# EAGLE design X13_Power_Distribution_C (EAGLE 9.6.2)
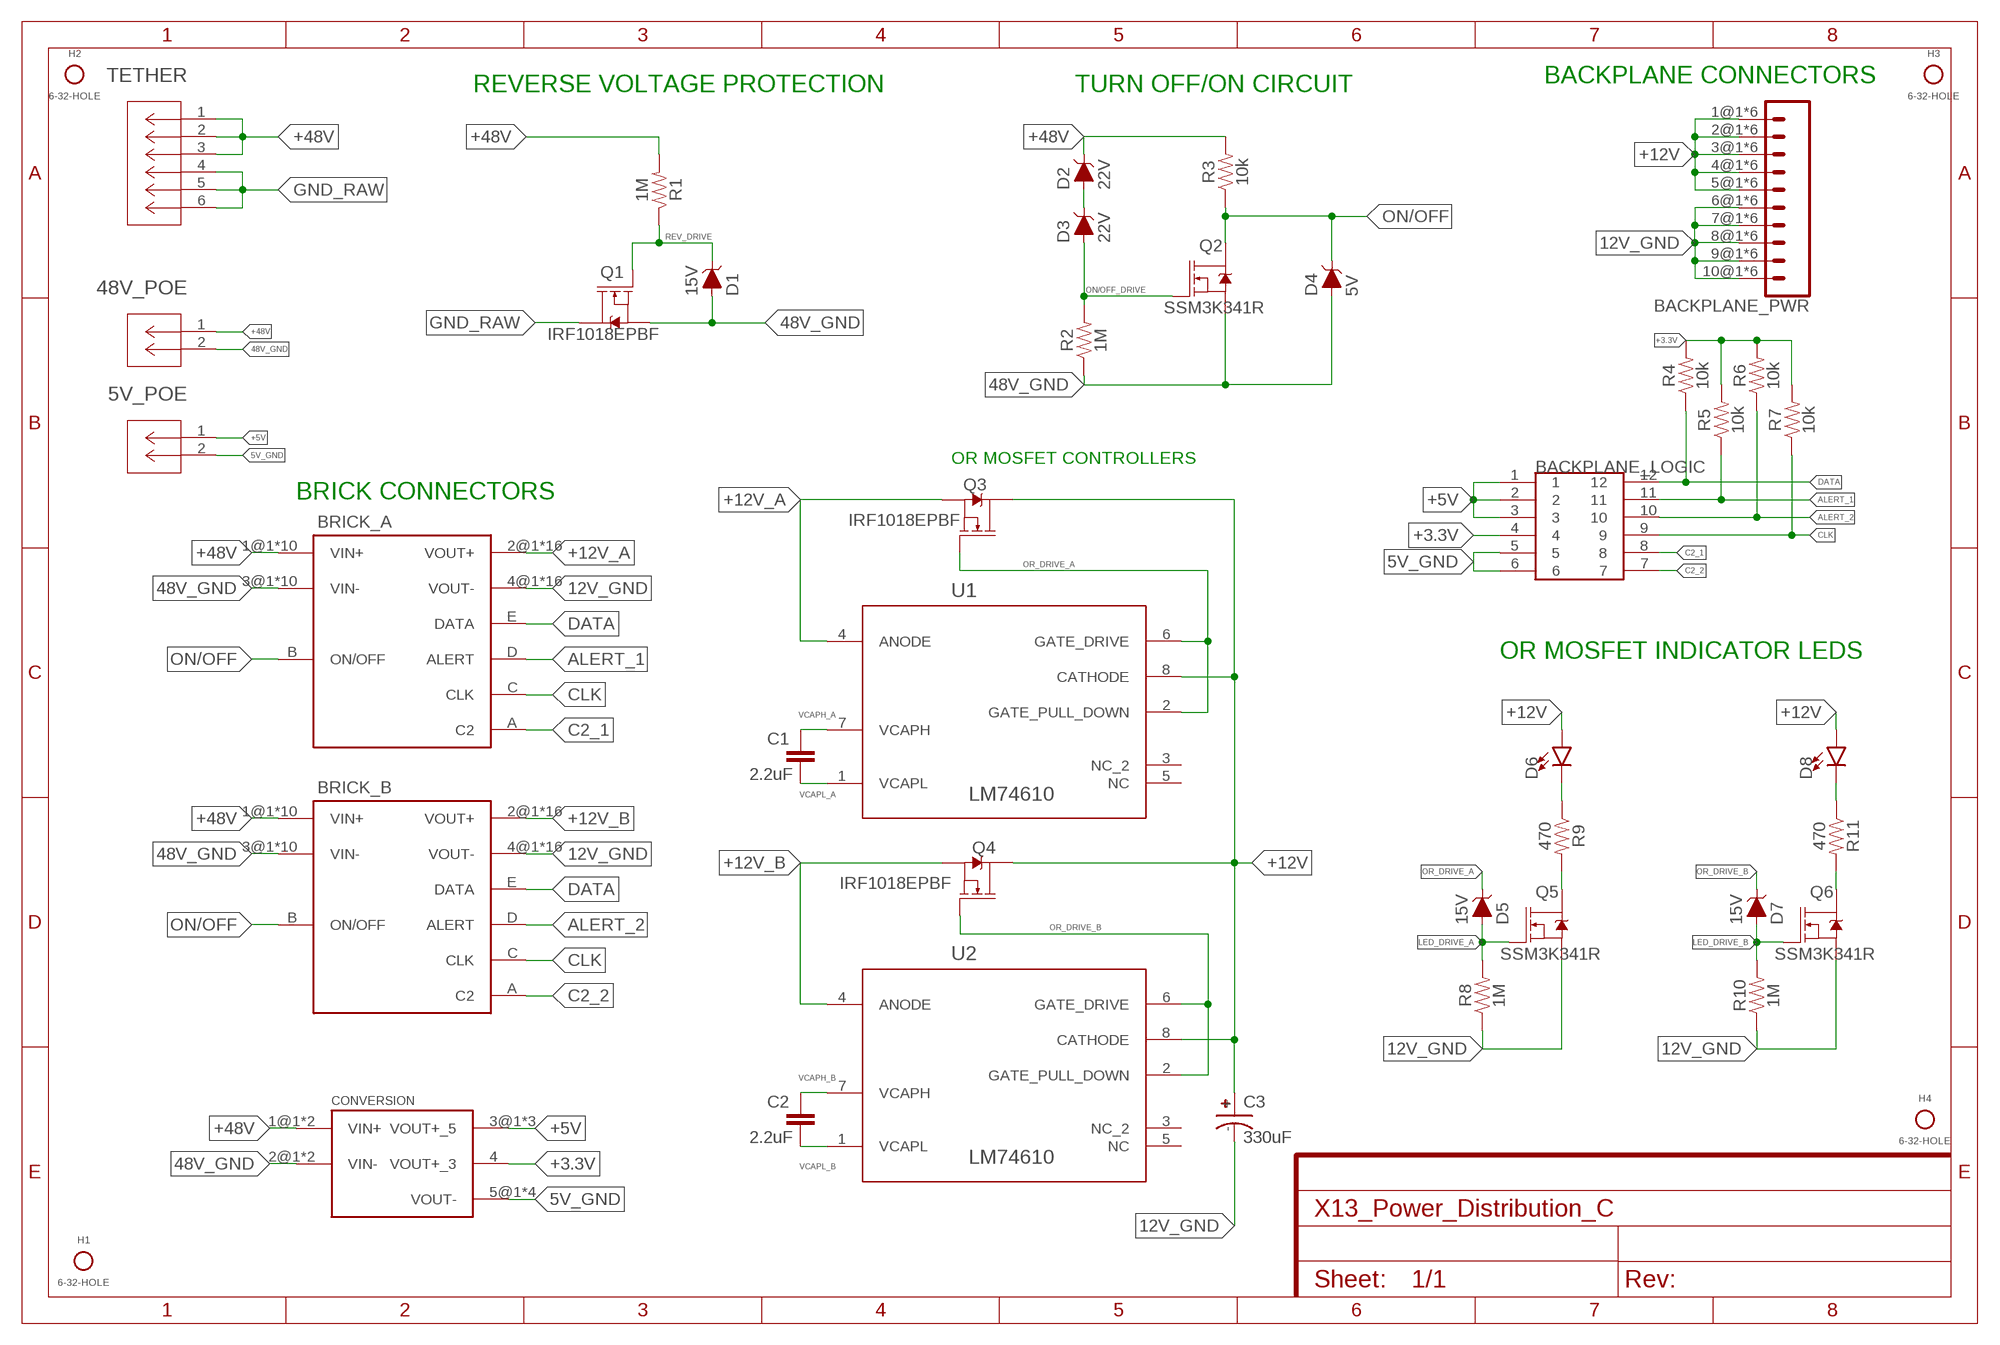
[diagram p0: schematic, sheet 1, part 1 of 2]
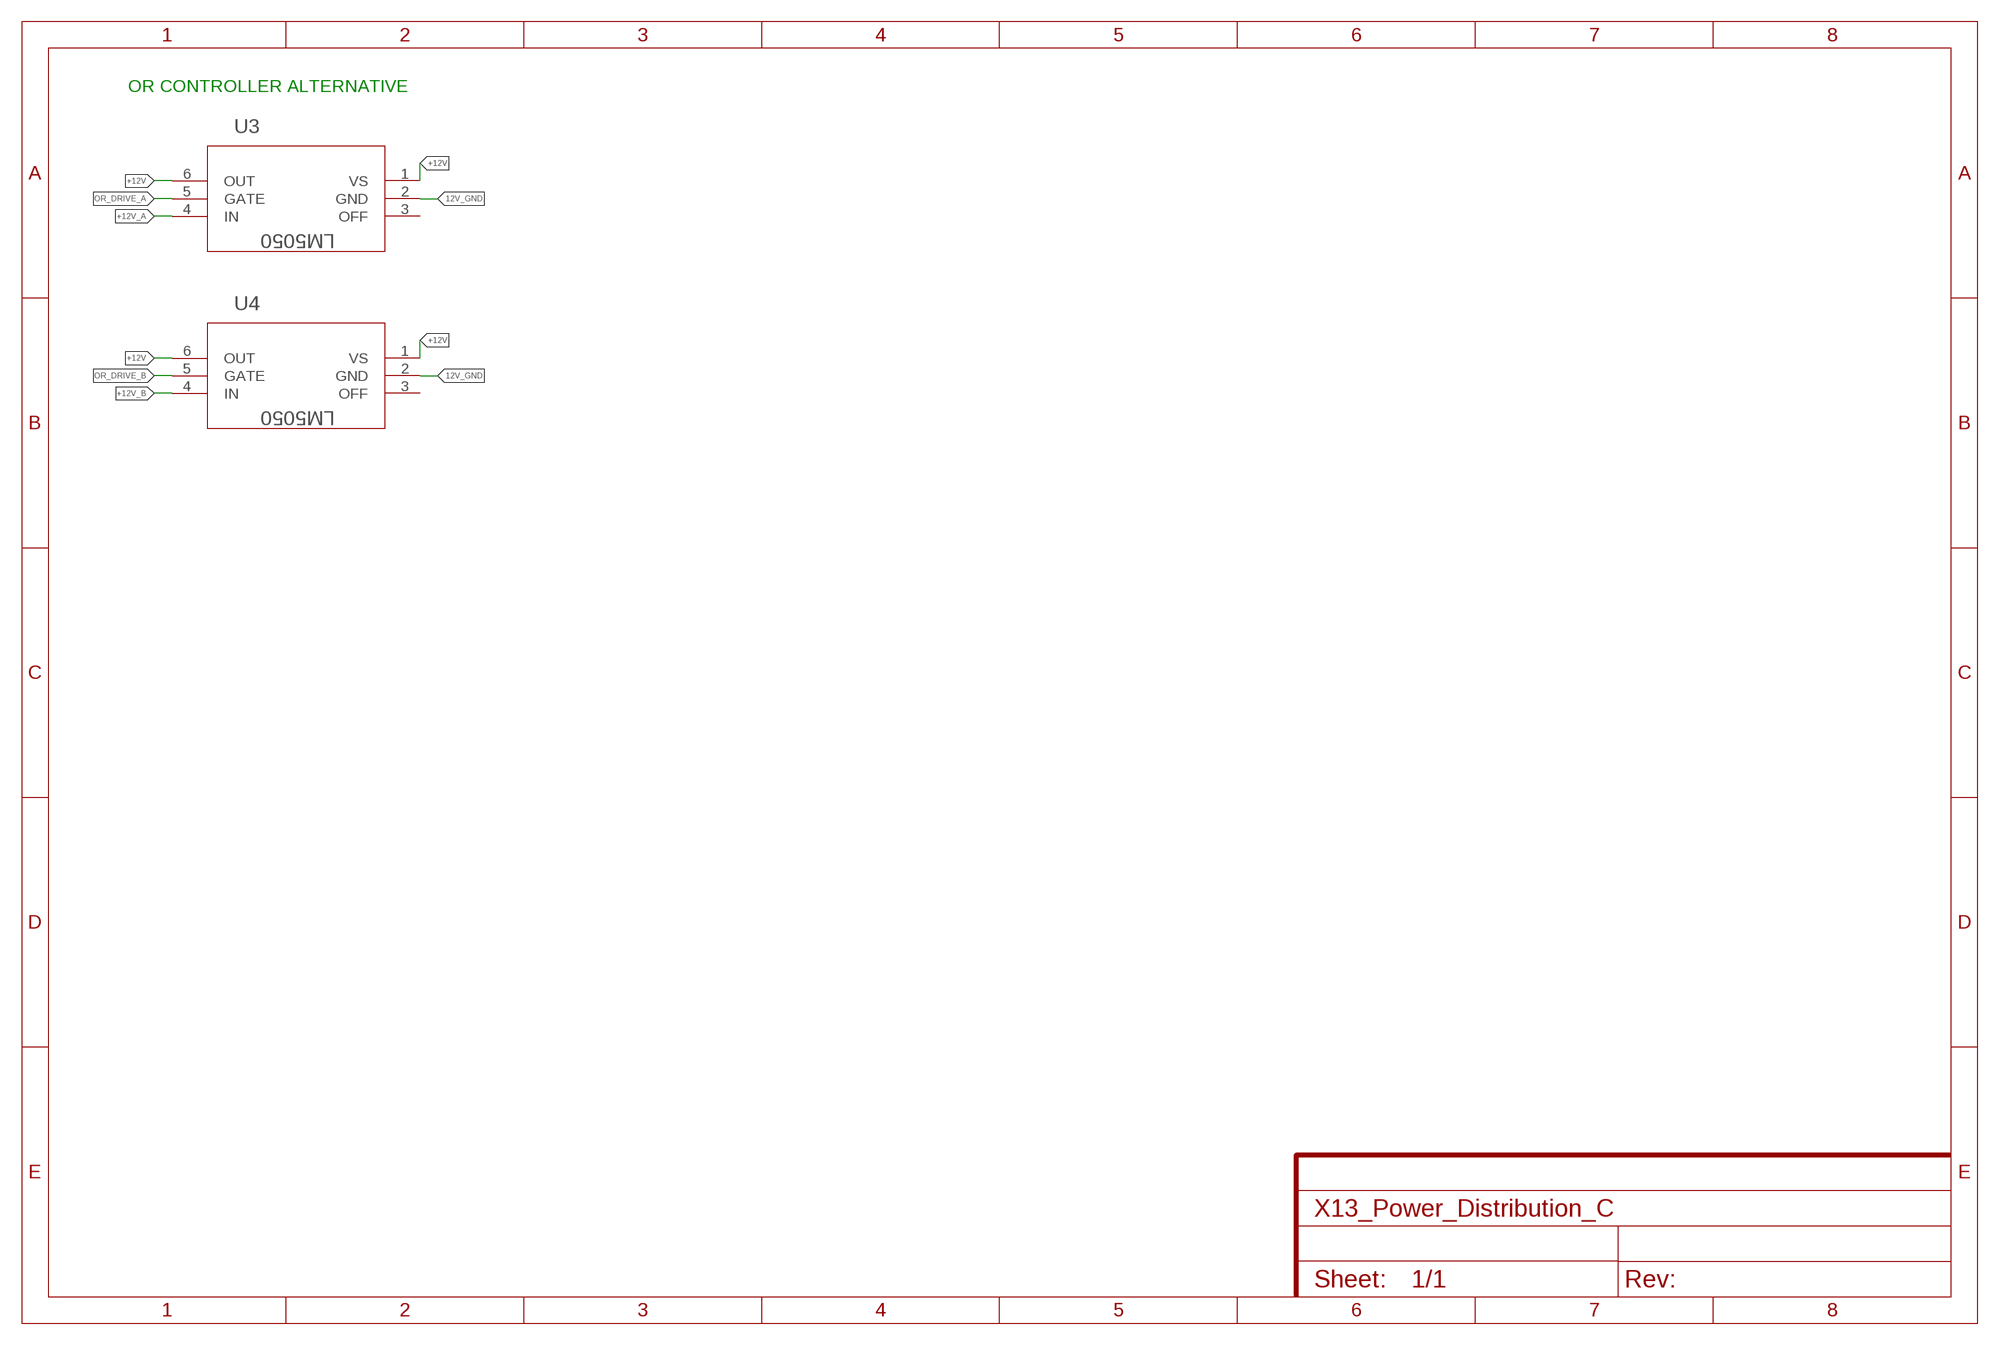
[diagram p1: schematic, sheet 1, part 2 of 2]

## Parts
5V_POE  POE_TERMINAL  [CONN2_282834-2_TEC]
48V_POE  POE_TERMINAL  [CONN2_282834-2_TEC]
BACKPLANE_LOGIC  IPL1-106-01-L-D-RE1-K  [IPL1-106-01-L-D-RE1-K]
BACKPLANE_PWR  MPPT-10-01-01-L-RA-SD  [MPPT-10-01-01-L-RA-SD]
BRICK_A  DIST2BRICK_C  [DIST2BRICK_C]
BRICK_B  DIST2BRICK_C  [DIST2BRICK_C]
C1  2.2uF  0.1UF-0603-100V-10%  [0603]
C2  2.2uF  0.1UF-0603-100V-10%  [0603]
C3  330uF  UCM1H331MNL1GS  [CAPAE1030X1050N]
CONVERSION  DIST2CON  [DIST2CON]
D1  15V  DIODE-ZENER-BZT52C3V6S  [SOD-323]
D2  22V  DIODE-ZENER-BZT52C3V6S  [SOD-323]
D3  22V  DIODE-ZENER-BZT52C3V6S  [SOD-323]
D4  5V  DIODE-ZENER-BZT52C3V6S  [SOD-323]
D5  15V  DIODE-ZENER-BZT52C3V6S  [SOD-323]
D6  LED0603  [LED-0603]
D7  15V  DIODE-ZENER-BZT52C3V6S  [SOD-323]
D8  LED0603  [LED-0603]
H1  6-32-HOLE  [6-32-HOLE]
H2  6-32-HOLE  [6-32-HOLE]
H3  6-32-HOLE  [6-32-HOLE]
H4  6-32-HOLE  [6-32-HOLE]
Q1  IRF1018EPBF  [TO263]
Q2  SSM3K341R  MOSFET-NCH-2N7002PW  [SOT323]
Q3  IRF1018EPBF  [TO263]
Q4  IRF1018EPBF  [TO263]
Q5  SSM3K341R  MOSFET-NCH-2N7002PW  [SOT323]
Q6  SSM3K341R  MOSFET-NCH-2N7002PW  [SOT323]
R1  1M  RESISTOR0603  [0603]
R2  1M  RESISTOR0603  [0603]
R3  10k  RESISTOR0603  [0603]
R4  10k  RESISTOR0603  [0603]
R5  10k  RESISTOR0603  [0603]
R6  10k  RESISTOR0603  [0603]
R7  10k  RESISTOR0603  [0603]
R8  1M  RESISTOR0603  [0603]
R9  470  RESISTOR0603  [0603]
R10  1M  RESISTOR0603  [0603]
R11  470  RESISTOR0603  [0603]
TETHER  48V  DIST_TO_TETHER  [CON6_P5MM_VER_TERM-BLK_TYC]
U1  LM74610  DIST_OR_DIODEDGK0008A_M  [DGK0008A_M]
U2  LM74610  DIST_OR_DIODEDGK0008A_M  [DGK0008A_M]
U3  LM5050  DIST_OR_CONTROL_ALTMK06A-M  [MK06A-M]
U4  LM5050  DIST_OR_CONTROL_ALTMK06A-M  [MK06A-M]

## Nets
5V_GND: 5V_POE.2 BACKPLANE_LOGIC.5 BACKPLANE_LOGIC.6 CONVERSION.5@1(VOUT-) CONVERSION.5@2(VOUT-) CONVERSION.5@3(VOUT-) CONVERSION.5@4(VOUT-)
12V_GND: BACKPLANE_PWR.6@1 BACKPLANE_PWR.6@2 BACKPLANE_PWR.6@3 BACKPLANE_PWR.6@4 BACKPLANE_PWR.6@5 BACKPLANE_PWR.6@6 BACKPLANE_PWR.7@1 BACKPLANE_PWR.7@2 BACKPLANE_PWR.7@3 BACKPLANE_PWR.7@4 BACKPLANE_PWR.7@5 BACKPLANE_PWR.7@6 BACKPLANE_PWR.8@1 BACKPLANE_PWR.8@2 BACKPLANE_PWR.8@3 BACKPLANE_PWR.8@4 BACKPLANE_PWR.8@5 BACKPLANE_PWR.8@6 BACKPLANE_PWR.9@1 BACKPLANE_PWR.9@2 BACKPLANE_PWR.9@3 BACKPLANE_PWR.9@4 BACKPLANE_PWR.9@5 BACKPLANE_PWR.9@6 BACKPLANE_PWR.10@1 BACKPLANE_PWR.10@2 BACKPLANE_PWR.10@3 BACKPLANE_PWR.10@4 BACKPLANE_PWR.10@5 BACKPLANE_PWR.10@6 BRICK_A.4@1(VOUT-) BRICK_A.4@2(VOUT-) BRICK_A.4@3(VOUT-) BRICK_A.4@4(VOUT-) BRICK_A.4@5(VOUT-) BRICK_A.4@6(VOUT-) BRICK_A.4@7(VOUT-) BRICK_A.4@8(VOUT-) BRICK_A.4@9(VOUT-) BRICK_A.4@10(VOUT-) BRICK_A.4@11(VOUT-) BRICK_A.4@12(VOUT-) BRICK_A.4@13(VOUT-) BRICK_A.4@14(VOUT-) BRICK_A.4@15(VOUT-) BRICK_A.4@16(VOUT-) BRICK_B.4@1(VOUT-) BRICK_B.4@2(VOUT-) BRICK_B.4@3(VOUT-) BRICK_B.4@4(VOUT-) BRICK_B.4@5(VOUT-) BRICK_B.4@6(VOUT-) BRICK_B.4@7(VOUT-) BRICK_B.4@8(VOUT-) BRICK_B.4@9(VOUT-) BRICK_B.4@10(VOUT-) BRICK_B.4@11(VOUT-) BRICK_B.4@12(VOUT-) BRICK_B.4@13(VOUT-) BRICK_B.4@14(VOUT-) BRICK_B.4@15(VOUT-) BRICK_B.4@16(VOUT-) C3.- Q5.2(S) Q6.2(S) R8.1 R10.1 U3.2(GND) U4.2(GND)
48V_GND: 48V_POE.2 BRICK_A.3@1(VIN-) BRICK_A.3@2(VIN-) BRICK_A.3@3(VIN-) BRICK_A.3@4(VIN-) BRICK_A.3@5(VIN-) BRICK_A.3@6(VIN-) BRICK_A.3@7(VIN-) BRICK_A.3@8(VIN-) BRICK_A.3@9(VIN-) BRICK_A.3@10(VIN-) BRICK_B.3@1(VIN-) BRICK_B.3@2(VIN-) BRICK_B.3@3(VIN-) BRICK_B.3@4(VIN-) BRICK_B.3@5(VIN-) BRICK_B.3@6(VIN-) BRICK_B.3@7(VIN-) BRICK_B.3@8(VIN-) BRICK_B.3@9(VIN-) BRICK_B.3@10(VIN-) CONVERSION.2@1(VIN-) CONVERSION.2@2(VIN-) D1.A D4.A Q1.2(S) Q2.2(S) R2.1
+3.3V: BACKPLANE_LOGIC.4 CONVERSION.4(VOUT+_3) R4.2 R5.2 R6.2 R7.2
+5V: 5V_POE.1 BACKPLANE_LOGIC.1 BACKPLANE_LOGIC.2 BACKPLANE_LOGIC.3 CONVERSION.3@1(VOUT+_5) CONVERSION.3@2(VOUT+_5) CONVERSION.3@3(VOUT+_5)
+12V: BACKPLANE_PWR.1@1 BACKPLANE_PWR.1@2 BACKPLANE_PWR.1@3 BACKPLANE_PWR.1@4 BACKPLANE_PWR.1@5 BACKPLANE_PWR.1@6 BACKPLANE_PWR.2@1 BACKPLANE_PWR.2@2 BACKPLANE_PWR.2@3 BACKPLANE_PWR.2@4 BACKPLANE_PWR.2@5 BACKPLANE_PWR.2@6 BACKPLANE_PWR.3@1 BACKPLANE_PWR.3@2 BACKPLANE_PWR.3@3 BACKPLANE_PWR.3@4 BACKPLANE_PWR.3@5 BACKPLANE_PWR.3@6 BACKPLANE_PWR.4@1 BACKPLANE_PWR.4@2 BACKPLANE_PWR.4@3 BACKPLANE_PWR.4@4 BACKPLANE_PWR.4@5 BACKPLANE_PWR.4@6 BACKPLANE_PWR.5@1 BACKPLANE_PWR.5@2 BACKPLANE_PWR.5@3 BACKPLANE_PWR.5@4 BACKPLANE_PWR.5@5 BACKPLANE_PWR.5@6 C3.+ D6.A D8.A Q3.3(D) Q4.3(D) U1.8(CATHODE) U2.8(CATHODE) U3.1(VS) U3.6(OUT) U4.1(VS) U4.6(OUT)
+12V_A: BRICK_A.2@1(VOUT+) BRICK_A.2@2(VOUT+) BRICK_A.2@3(VOUT+) BRICK_A.2@4(VOUT+) BRICK_A.2@5(VOUT+) BRICK_A.2@6(VOUT+) BRICK_A.2@7(VOUT+) BRICK_A.2@8(VOUT+) BRICK_A.2@9(VOUT+) BRICK_A.2@10(VOUT+) BRICK_A.2@11(VOUT+) BRICK_A.2@12(VOUT+) BRICK_A.2@13(VOUT+) BRICK_A.2@14(VOUT+) BRICK_A.2@15(VOUT+) BRICK_A.2@16(VOUT+) Q3.2(S) U1.4(ANODE) U3.4(IN)
+12V_B: BRICK_B.2@1(VOUT+) BRICK_B.2@2(VOUT+) BRICK_B.2@3(VOUT+) BRICK_B.2@4(VOUT+) BRICK_B.2@5(VOUT+) BRICK_B.2@6(VOUT+) BRICK_B.2@7(VOUT+) BRICK_B.2@8(VOUT+) BRICK_B.2@9(VOUT+) BRICK_B.2@10(VOUT+) BRICK_B.2@11(VOUT+) BRICK_B.2@12(VOUT+) BRICK_B.2@13(VOUT+) BRICK_B.2@14(VOUT+) BRICK_B.2@15(VOUT+) BRICK_B.2@16(VOUT+) Q4.2(S) U2.4(ANODE) U4.4(IN)
+48V: 48V_POE.1 BRICK_A.1@1(VIN+) BRICK_A.1@2(VIN+) BRICK_A.1@3(VIN+) BRICK_A.1@4(VIN+) BRICK_A.1@5(VIN+) BRICK_A.1@6(VIN+) BRICK_A.1@7(VIN+) BRICK_A.1@8(VIN+) BRICK_A.1@9(VIN+) BRICK_A.1@10(VIN+) BRICK_B.1@1(VIN+) BRICK_B.1@2(VIN+) BRICK_B.1@3(VIN+) BRICK_B.1@4(VIN+) BRICK_B.1@5(VIN+) BRICK_B.1@6(VIN+) BRICK_B.1@7(VIN+) BRICK_B.1@8(VIN+) BRICK_B.1@9(VIN+) BRICK_B.1@10(VIN+) CONVERSION.1@1(VIN+) CONVERSION.1@2(VIN+) D2.C R1.2 R3.2 TETHER.1 TETHER.2 TETHER.3
ALERT_1: BACKPLANE_LOGIC.11 BRICK_A.D(ALERT) R5.1
ALERT_2: BACKPLANE_LOGIC.10 BRICK_B.D(ALERT) R6.1
C2_1: BACKPLANE_LOGIC.8 BRICK_A.A(C2)
C2_2: BACKPLANE_LOGIC.7 BRICK_B.A(C2)
CLK: BACKPLANE_LOGIC.9 BRICK_A.C(CLK) BRICK_B.C(CLK) R7.1
DATA: BACKPLANE_LOGIC.12 BRICK_A.E(DATA) BRICK_B.E(DATA) R4.1
GND_RAW: Q1.3(D) TETHER.4 TETHER.5 TETHER.6
LED_DRIVE_A: D5.A Q5.1(G) R8.2
LED_DRIVE_B: D7.A Q6.1(G) R10.2
N$1: D2.A D3.C
N$4: Q5.3(D) R9.2
N$5: D6.C R9.1
N$6: Q6.3(D) R11.2
N$7: D8.C R11.1
ON/OFF: BRICK_A.B(ON/OFF) BRICK_B.B(ON/OFF) D4.C Q2.3(D) R3.1
ON/OFF_DRIVE: D3.A Q2.1(G) R2.2
OR_DRIVE_A: D5.C Q3.1(G) U1.2(GATE_PULL_DOWN) U1.6(GATE_DRIVE) U3.5(GATE)
OR_DRIVE_B: D7.C Q4.1(G) U2.2(GATE_PULL_DOWN) U2.6(GATE_DRIVE) U4.5(GATE)
REV_DRIVE: D1.C Q1.1(G) R1.1
VCAPH_A: C1.1 U1.7(VCAPH)
VCAPH_B: C2.1 U2.7(VCAPH)
VCAPL_A: C1.2 U1.1(VCAPL)
VCAPL_B: C2.2 U2.1(VCAPL)
Unconnected: U1.3(NC_2) U1.5(NC) U2.3(NC_2) U2.5(NC) U3.3(OFF) U4.3(OFF)

## Notes on the sheet
- BACKPLANE CONNECTORS
- REVERSE VOLTAGE PROTECTION | TURN OFF/ON CIRCUIT | OR CONTROLLER ALTERNATIVE
- OR MOSFET CONTROLLERS
- BRICK CONNECTORS
- OR MOSFET INDICATOR LEDS

## Library data of the parts
5V_POE 48V_POE = Dist_POE:POE_TERMINAL; BUILT_BY: EMA_UL_Team; COPYRIGHT: Copyright (C) 2016 Accelerated Designs. All rights reserved; DESCRIPTION: TERMI-BLOK PCB MOUNT, 90 2P.; MANUFACTURER_PART_NUMBER: 282834-2; PITCH_MM_: 2.54; POSITIONS: 2; PRODUCT: Terminal Block Headers & Receptacles; ROWS-CONFIG: 1; SOURCELIBRARY: TE_Connectivity-2018-03-16; TE_PART_NUMBER: 282834-2; TYPE: Receptacle; VENDOR: TE Connectivity
BACKPLANE_LOGIC = Backplane_Dist_Logic_Connector:IPL1-106-01-L-D-RE1-K
BACKPLANE_PWR = Samtec MPPT Hermaphoditic 10 pos - MPPT-10-01-01-L-RA-SD:MPPT-10-01-01-L-RA-SD: Samtec MPPT Connector Right Angle Vertically mating Non-gendered https://www.samtec.com/products/mppt-10-01-01-l-ra-sd
BRICK_A BRICK_B = Brick_Dist_Connector:DIST2BRICK_C
C1 C2 = SparkFun-Capacitors:0.1UF: 0.1µF ceramic capacitors A capacitor is a passive two-terminal electrical component used to store electrical energy temporarily in an electric field.; PROD_ID: CAP-08390; VALUE: 0.1uF
C3 = brick-capacitor-UCM1H331MNL1GS:UCM1H331MNL1GS: Nichicon 330uF 50 V Aluminium Electrolytic Capacitor SMD, CM Series 2000h 10 (Dia.) x 10mm Source: Datasheet <http://www.nichicon.co.jp/english/products/pdfs/e-ucm.pdf>; ARROW_PART_NUMBER: UCM1H331MNL1GS; ARROW_PRICE-STOCK: https://www.arrow.com/en/products/ucm1h331mnl1gs/nichicon; DESCRIPTION: Nichicon 330uF 50 V Aluminium Electrolytic Capacitor SMD, CM Series 2000h 10 (Dia.) x 10mm; HEIGHT: 10.5mm; MANUFACTURER_NAME: Nichicon; MANUFACTURER_PART_NUMBER: UCM1H331MNL1GS; MOUSER_PART_NUMBER: 647-UCM1H331MNL1GS; MOUSER_PRICE-STOCK: https://www.mouser.co.uk/ProductDetail/Nichicon/UCM1H331MNL1GS?qs=DSgADHjnLTkTovFLdbC%252BNg%3D%3D
CONVERSION = Dist_Convert_Connector:DIST2CON
D1-D5 D7 = SparkFun-DiscreteSemi:DIODE-ZENER: Zener Diode A Zener diode allows current to flow from its anode to its cathode like a normal semiconductor diode, but it also permits current to flow in the reverse direction when its "Zener voltage" is reached. - WIkipedia; PROD_ID: DIO-08199; VALUE: 3.6V
D6 D8 = SparkFun-LED:LED: LED (Generic) Standard schematic elements and footprints for 5mm, 3mm, 1206, and 0603 sized LEDs. Generic LEDs with no color specified.
H1-H4 = Mounting Holes:6-32-HOLE
Q1 Q3 Q4 = Reverse_Voltage_NMOS:IRF1018EPBF
Q2 Q5 Q6 = SparkFun-DiscreteSemi:MOSFET-NCH: N-channel MOSFETs Voltage controlled devices that allow control of high current outputs. SparkFun Products: SparkFun OpenScale <https://www.sparkfun.com/products/13261> SparkFun Digital Sandbox <https://www.sparkfun.com/products/12651> SparkFun Monster Moto Shield <https://www.sparkfun.com/products/10182> SparkFun MOSFET Power Controller <https://www.sparkfun.com/products/11214>; PROD_ID: TRANS-11151; VALUE: 310mA/60V/1.6Ω
R1 R4-R7 R9 R11 = SparkFun-Resistors:RESISTOR: Generic Resistor Package
R2 R3 R8 R10 = SparkFun-Resistors:RESISTOR: Generic Resistor Package; SPICEPREFIX: R
TETHER = Dist_To_Tether_Connector:DIST_TO_TETHER; BUILT_BY: EMA_UL_Team; MANUFACTURER_PART_NUMBER: 796636-6; SOURCELIBRARY: Tyco_2012-04-26; VENDOR: TE Connectivity
U1 U2 = Dist_OR_Controller:DIST_OR_DIODE; APPLICATION_BUILDNUMBER: *; COMPTYPE: IC; MANUFACTURER: Texas Instruments; MOUNTTYPE: SMT; PACKAGEREFERENCE: DGK0008A; PARTNUMBER: LM74610QDGKRQ1; PIN_COUNT: 8; REFDES: RefDes; TYPE: TYPE; VALUE: Value
U3 U4 = Dist_OR_Controller:DIST_OR_CONTROL_ALT; BASEPN: LM5050-1; DATASHEETURL: http://www.ti.com/lit/ds/symlink/lm5050-1.pdf; DESCRIPTION: High Side OR-ing FET Controller; MANUFACTURER: Texas Instruments; MANUFACTURER_PART_NUMBER: LM5050MK-1/NOPB; NSC_PACKAGEREFERENCE: MK06A; VENDOR: Texas Instruments

## Net classes
0 default: width 0.203 mm, clearance 0.205 mm

## Board
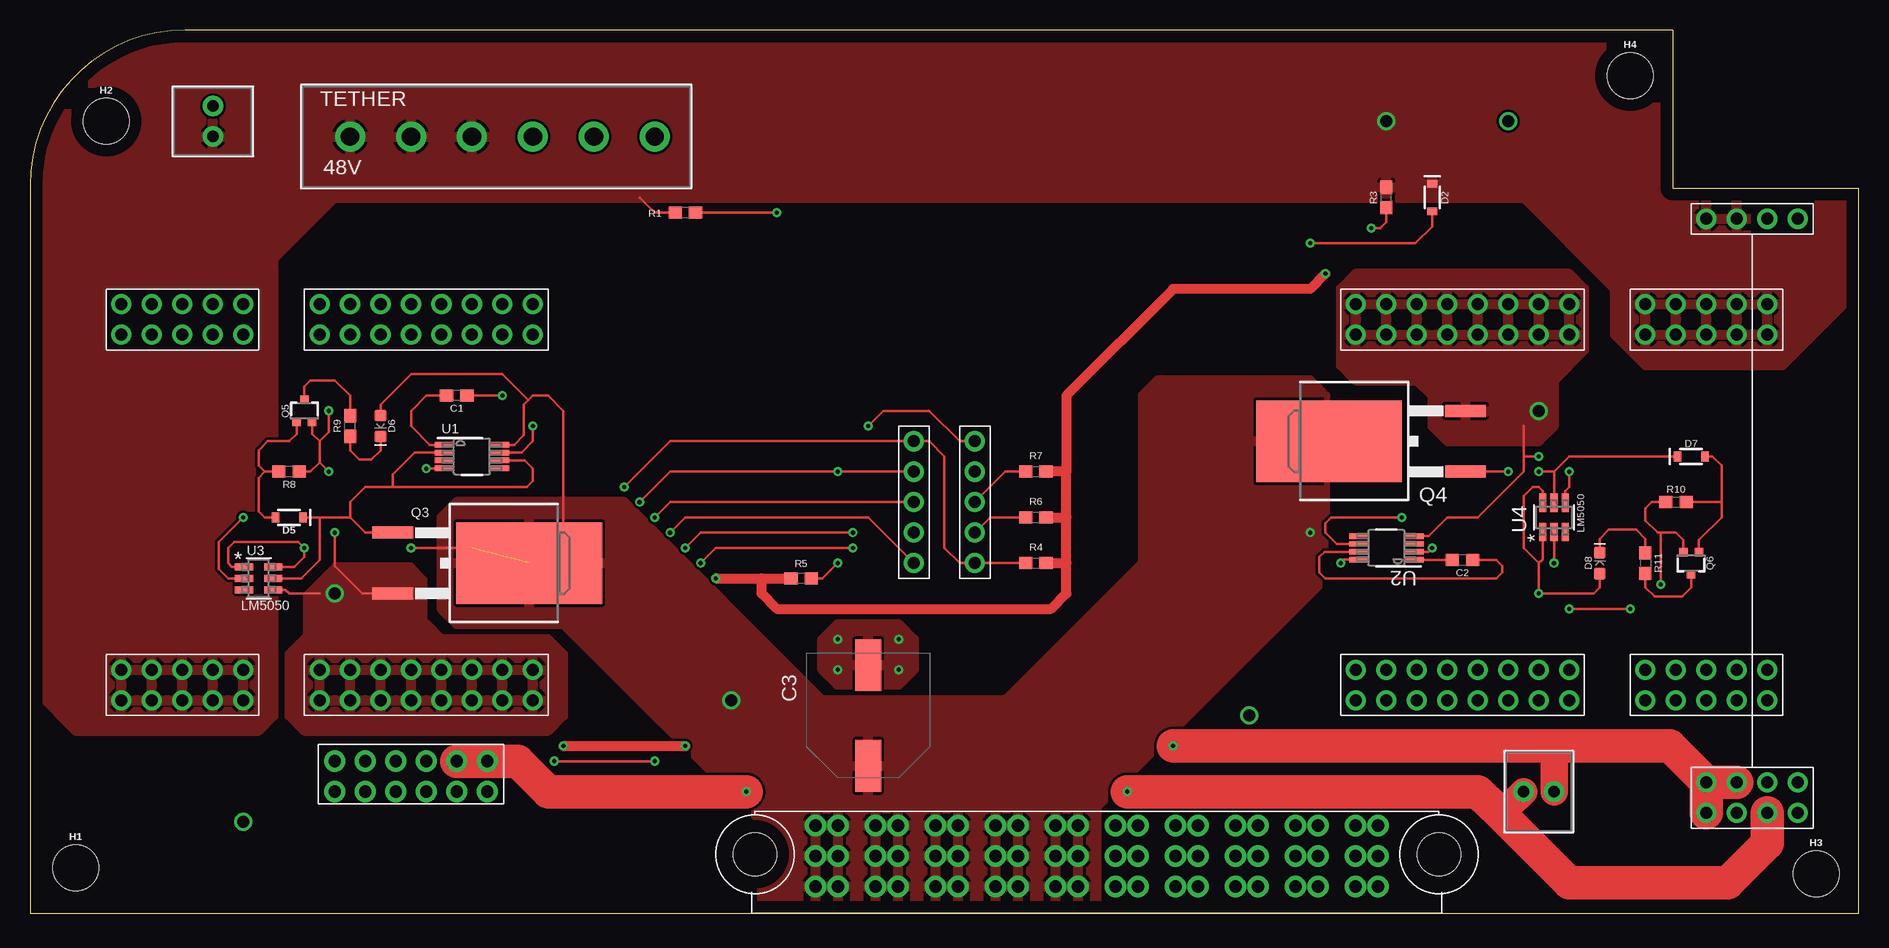
[diagram p2: board, top side]
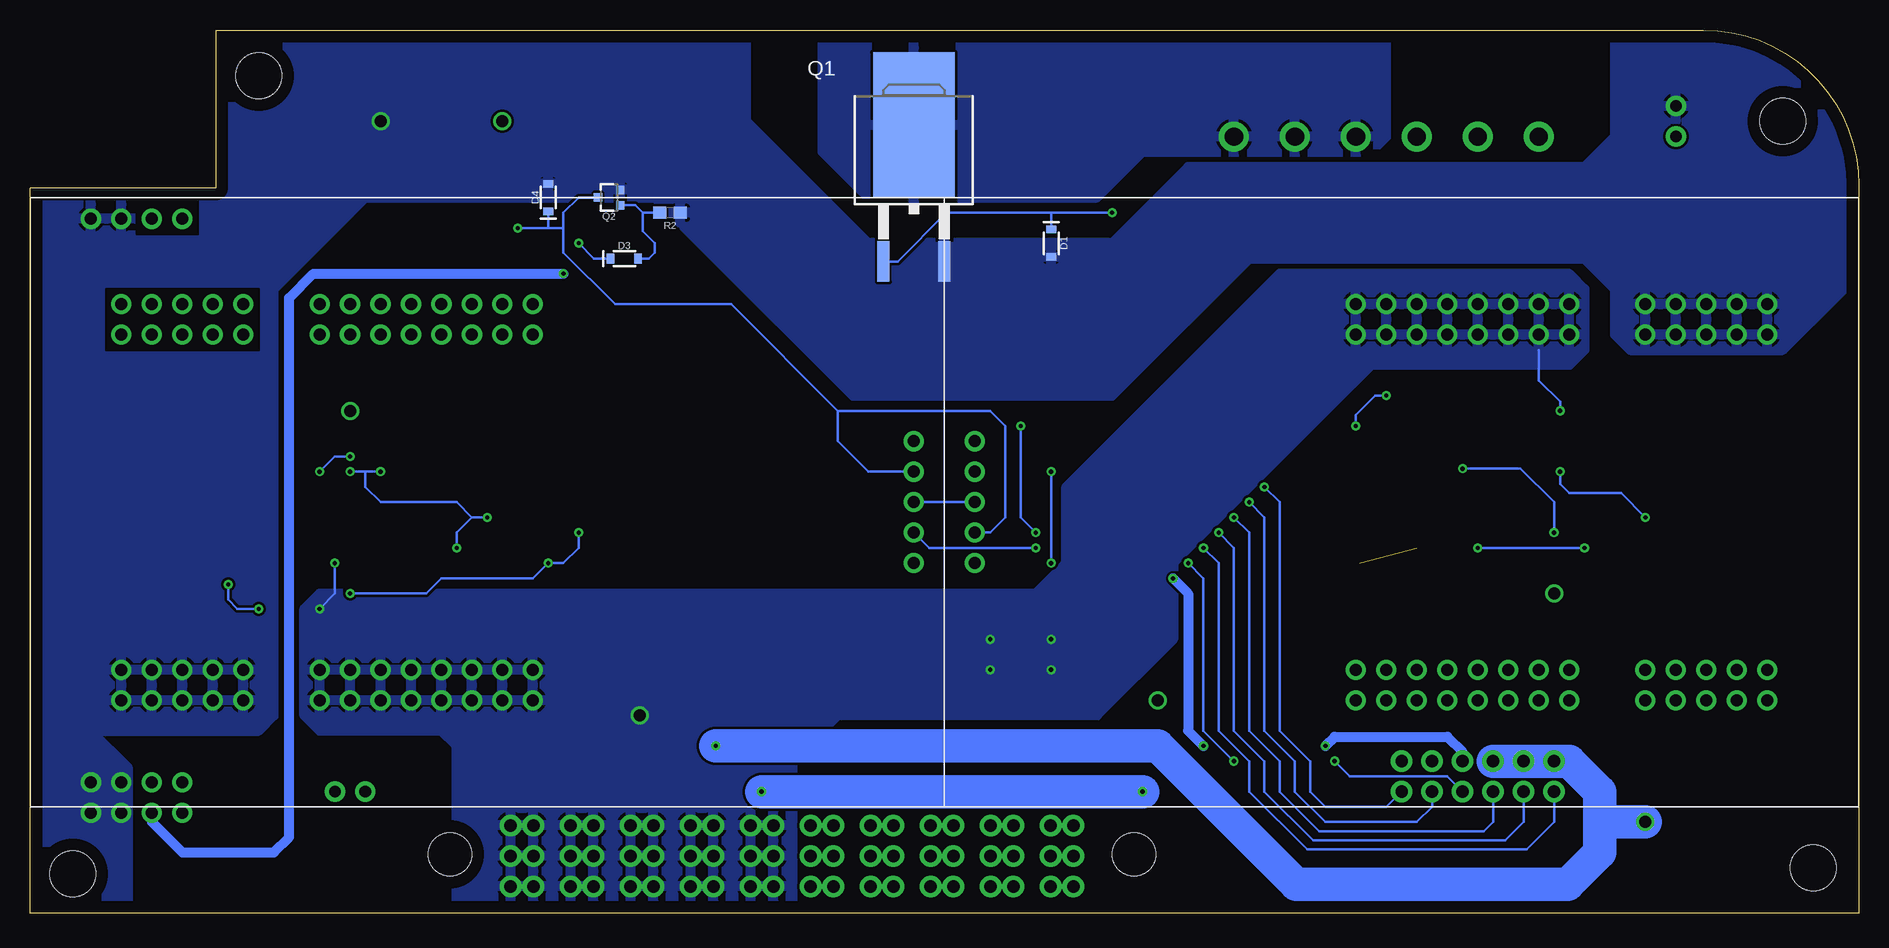
[diagram p3: board, bottom side, seen from below]

Size 152.4 x 73.66 mm. Coordinates in mm from the lower left corner, seen from the top.
Outline: 0,0 152.4,0 152.4,60.45 136.91,60.45 136.91,73.66 12.95,73.66 arc90 0,60.71 0,0
Copper layers (1*16): Top 0.035mm / dielectric 1.5mm / Bottom 0.035mm
Design rules "default": minimum track width 6mil, minimum drill 0.35mm, track to track 6mil, track to pad 6mil, pad to pad 6mil, via to via 6mil, smd to smd 6mil, copper to edge 40mil, drill to drill 6mil, minimum pad ring 10mil, minimum via ring 8mil, stop-mask expansion 4mil, vias tented up to drill 0mil, thermal gap 10mil

### Footprints (pad centres in the part's own frame; a part is rotated, then mirrored left to right if it is on the bottom)
CONN2_282834-2_TEC = drill 0.965 pad 1.7: 1 0,0; 2 2.54,0
IPL1-106-01-L-D-RE1-K = drill 1.016 pad 1.778: 1 0,0; 2 2.54,0; 3 5.08,0; 4 7.62,0; 5 10.16,0; 6 12.7,0; 7 0,-2.54; 8 2.54,-2.54; 9 5.08,-2.54; 10 7.62,-2.54; 11 10.16,-2.54; 12 12.7,-2.54
MPPT-10-01-01-L-RA-SD = drill 1.04 pad 1.8: 1@1 -23.44,2.26; 1@2 -21.56,2.26; 1@3 -23.44,4.8; 1@4 -21.56,4.8; 1@5 -23.44,7.34; 1@6 -21.56,7.34; 2@1 -18.44,2.26; 2@2 -16.56,2.26; 2@3 -18.44,4.8; 2@4 -16.56,4.8; 2@5 -18.44,7.34; 2@6 -16.56,7.34; 3@1 -13.44,2.26; 3@2 -11.56,2.26; 3@3 -13.44,4.8; 3@4 -11.56,4.8; 3@5 -13.44,7.34; 3@6 -11.56,7.34; 4@1 -8.44,2.26; 4@2 -6.56,2.26; 4@3 -8.44,4.8; 4@4 -6.56,4.8; 4@5 -8.44,7.34; 4@6 -6.56,7.34; 5@1 -3.44,2.26; 5@2 -1.56,2.26; 5@3 -3.44,4.8; 5@4 -1.56,4.8; 5@5 -3.44,7.34; 5@6 -1.56,7.34; 6@1 1.56,2.26; 6@2 3.44,2.26; 6@3 1.56,4.8; 6@4 3.44,4.8; 6@5 1.56,7.34; 6@6 3.44,7.34; 7@1 6.56,2.26; 7@2 8.44,2.26; 7@3 6.56,4.8; 7@4 8.44,4.8; 7@5 6.56,7.34; 7@6 8.44,7.34; 8@1 11.56,2.26; 8@2 13.44,2.26; 8@3 11.56,4.8; 8@4 13.44,4.8; 8@5 11.56,7.34; 8@6 13.44,7.34; 9@1 16.56,2.26; 9@2 18.44,2.26; 9@3 16.56,4.8; 9@4 18.44,4.8; 9@5 16.56,7.34; 9@6 18.44,7.34; 10@1 21.56,2.26; 10@2 23.44,2.26; 10@3 21.56,4.8; 10@4 23.44,4.8; 10@5 21.56,7.34; 10@6 23.44,7.34 | hole 3.6: 28.5,4.93; -28.5,4.93
DIST2BRICK_C = drill 1 pad 1.676: 1@1 -30.48,-16.51; 1@2 -30.48,-13.97; 1@3 -27.94,-16.51; 1@4 -27.94,-13.97; 1@5 -25.4,-16.51; 1@6 -25.4,-13.97; 1@7 -22.86,-16.51; 1@8 -22.86,-13.97; 1@9 -20.32,-16.51; 1@10 -20.32,-13.97; 2@1 -13.97,-16.51; 2@2 -13.97,-13.97; 2@3 -11.43,-16.51; 2@4 -11.43,-13.97; 2@5 -8.89,-16.51; 2@6 -8.89,-13.97; 2@7 -6.35,-16.51; 2@8 -6.35,-13.97; 2@9 -3.81,-16.51; 2@10 -3.81,-13.97; 2@11 -1.27,-16.51; 2@12 -1.27,-13.97; 2@13 1.27,-16.51; 2@14 1.27,-13.97; 2@15 3.81,-16.51; 2@16 3.81,-13.97; 3@1 -30.48,13.97; 3@2 -30.48,16.51; 3@3 -27.94,13.97; 3@4 -27.94,16.51; 3@5 -25.4,13.97; 3@6 -25.4,16.51; 3@7 -22.86,13.97; 3@8 -22.86,16.51; 3@9 -20.32,13.97; 3@10 -20.32,16.51; 4@1 -13.97,13.97; 4@2 -13.97,16.51; 4@3 -11.43,13.97; 4@4 -11.43,16.51; 4@5 -8.89,13.97; 4@6 -8.89,16.51; 4@7 -6.35,13.97; 4@8 -6.35,16.51; 4@9 -3.81,13.97; 4@10 -3.81,16.51; 4@11 -1.27,13.97; 4@12 -1.27,16.51; 4@13 1.27,13.97; 4@14 1.27,16.51; 4@15 3.81,13.97; 4@16 3.81,16.51; A 35.56,-5.08; B 35.56,-2.54; C 35.56,0; D 35.56,2.54; E 35.56,5.08
0603 = smd 1.1 x 1: 1 -0.85,0; 2 0.85,0
CAPAE1030X1050N = smd 4.3 x 2.15: + -4.2,0; - 4.2,0
DIST2CON = drill 1 pad 1.676: 1@1 -3.81,22.86; 1@2 -1.27,22.86; 2@1 1.27,22.86; 2@2 3.81,22.86; 3@1 -3.81,-26.67; 3@2 -3.81,-24.13; 3@3 -1.27,-24.13; 4 -1.27,-26.67; 5@1 1.27,-26.67; 5@2 1.27,-24.13; 5@3 3.81,-26.67; 5@4 3.81,-24.13
SOD-323 = smd 0.63 x 0.83: A 1.15,0; C -1.15,0
LED-0603 = smd 1 x 1: A -0.877,0; C 0.877,0
6-32-HOLE = hole 3.81: 0,0
TO263 = smd 1 x 3.4: 1 -2.54,-6.6; 2 2.54,-6.6 | smd 6.8 x 12.14: 3 0,4.77
SOT323 = smd 0.7 x 0.7: 1 -0.65,-0.925; 2 0.65,-0.925; 3 0,0.925
CON6_P5MM_VER_TERM-BLK_TYC = drill 1.524 pad 2.5: 1 0,0; 2 5.08,0; 3 10.16,0; 4 15.24,0; 5 20.32,0; 6 25.4,0
DGK0008A_M = smd 1.55 x 0.45: 1 -2.325,0.975; 2 -2.325,0.325; 3 -2.325,-0.325; 4 -2.325,-0.975; 5 2.325,-0.975; 6 2.325,-0.325; 7 2.325,0.325; 8 2.325,0.975
MK06A-M = smd 1.524 x 0.584: 1 -1.219,0.95; 2 -1.219,0; 3 -1.219,-0.95; 4 1.219,-0.95; 5 1.219,0; 6 1.219,0.95

### Placement (x,y rotation side)
5V_POE  127,10.16 180 top
48V_POE  15.24,64.77 90 top
BACKPLANE_LOGIC  25.4,12.7 0 top
BACKPLANE_PWR  88.9,0 0 top
BRICK_A  38.1,34.29 0 top
BRICK_B  114.3,34.29 180 top
C1  35.56,43.18 180 top
C2  119.38,29.46 180 top
C3  69.85,16.51 90 top
CONVERSION  143.51,35.05 0 top
D1  67.31,55.88 270 bottom
D2  116.84,59.69 270 top
D3  102.87,54.61 0 bottom
D4  109.22,59.69 90 bottom
D5  21.59,33.02 180 top
D6  29.21,40.64 270 top
D7  138.43,38.1 0 top
D8  130.81,29.21 90 top
H1  3.81,3.81 0 top
H2  6.35,66.04 0 top
H3  148.84,3.3 0 top
H4  133.35,69.85 0 top
Q1  78.74,60.96 0 bottom
Q2  104.14,59.69 90 bottom
Q3  36.83,29.21 270 top
Q4  113.03,39.37 90 top
Q5  22.86,41.91 0 top
Q6  138.43,29.21 180 top
R1  54.61,58.42 180 top
R2  99.06,58.42 180 bottom
R3  113.03,59.69 90 top
R4  83.82,29.21 0 top
R5  64.26,27.94 180 top
R6  83.82,33.02 0 top
R7  83.82,36.83 0 top
R8  21.59,36.83 180 top
R9  26.67,40.64 90 top
R10  137.16,34.29 0 top
R11  134.62,29.21 270 top
TETHER  26.67,64.77 0 top
U1  36.83,38.1 0 top
U2  113.03,30.48 180 top
U3  19.05,27.94 0 top
U4  127,33.02 90 top

### Tracks (layer width: path | path; a pad name or v marks a point on that pad's centre or on a via)
5V_GND  (via drill 0.35)
  Top 2.286: 121.92,8.89 123.19,8.89 5V_POE.2
  Top 2.794: v91.44,10.16 120.65,10.16 121.92,8.89 128.27,2.54 141.48,2.54 144.78,5.84 CONVERSION.5@1 | v59.69,10.16 44.45,10.16 43.18,10.16 40.64,12.7 BACKPLANE_LOGIC.6 BACKPLANE_LOGIC.5
  Bottom 2.794: v59.69,10.16 v91.44,10.16
  pour Bottom (no thermals): 144.27,12.19 144.27,-0.76 147.32,-3.81 151.13,-3.81 156.21,1.27 156.21,25.4 153.67,27.94 148.59,27.94 147.32,26.67 147.32,15.24
12V_GND  (via drill 0.35, 1)
  Top 0.203: Q5.2 23.51,39.99 24.13,39.37 | 24.13,39.37 24.13,37.59 | 24.13,37.59 23.37,36.83 R8.1 | 24.13,39.37 24.89,40.13 v24.89,41.91 | Q6.2 137.78,31.13 137.16,31.75 135.89,31.75 | 135.89,31.75 135.64,31.75 134.62,32.77 134.62,33.78 135.13,34.29 R10.1 | 135.89,31.75 v135.89,27.43 | v133.35,25.4 v128.27,25.4 | U3.2 16.51,27.94 15.75,28.7 15.75,30.99 v17.78,33.02 | v24.89,36.83 24.13,37.59 | v127,29.21 U4.2
  Bottom 0.203: v24.89,41.91 24.89,42.67 26.67,44.45 26.67,46.99 | v135.89,27.43 135.89,26.16 135.13,25.4 v133.35,25.4 | v17.78,33.02 19.81,35.05 24.13,35.05 24.89,35.81 v24.89,36.83 | v128.27,25.4 127,26.67 v127,29.21
  other vias: 101.6,16.51 67.31,22.86 67.31,20.32 72.39,20.32 72.39,22.86
  pour Bottom: 88.9,-1.27 92.71,-5.08 111.76,-5.08 116.84,0 116.84,13.97 118.11,15.24 128.27,15.24 129.54,16.51 129.54,25.4 128.27,26.67 68.58,26.67 66.04,29.21 66.04,35.56 48.26,53.34 24.13,53.34 22.86,52.07 22.86,46.99 24.13,45.72 40.64,45.72 57.15,29.21 57.15,22.86 63.5,16.51 85.09,16.51 88.9,12.7
  pour Top: 66.04,22.86 67.31,24.13 72.39,24.13 73.66,22.86 73.66,20.32 72.39,19.05 67.31,19.05 66.04,20.32
48V_GND  (via drill 1)
  other vias: 123.19,66.04
  pour Bottom: 20.32,48.26 19.05,46.99 6.35,46.99 -3.81,57.15 -3.81,67.31 6.35,77.47 17.78,77.47 20.32,74.93 20.32,64.77 22.86,62.23 55.88,62.23 62.23,55.88 82.55,55.88 92.71,66.04 92.71,74.93 95.25,77.47 144.78,77.47 156.21,66.04 156.21,22.86 148.59,15.24 133.35,15.24 132.08,16.51 132.08,52.07 124.46,59.69 100.33,59.69 83.82,43.18 62.23,43.18 50.8,54.61 22.86,54.61 20.32,52.07
  pour Bottom (no thermals): 73.66,54.61 74.93,55.88 77.47,55.88 78.74,54.61 78.74,53.34 77.47,52.07 74.93,52.07 73.66,53.34
  cutout Bottom: 133.35,52.07 146.05,52.07 146.05,46.99 133.35,46.99
  cutout Bottom: 138.43,59.18 138.43,56.64 143.51,56.64 143.51,59.18
+3.3V  (via drill 0.35)
  Top 0.813: v57.15,27.94 60.96,27.94 | 86.36,36.83 86.36,43.18 95.25,52.07 106.68,52.07 v107.95,53.34 | 86.36,36.83 R7.2 | R6.2 86.36,33.02 | 86.36,33.02 86.36,36.83 | R4.2 86.36,29.21 | 86.36,29.21 86.36,33.02 | 86.36,29.21 86.36,26.67 85.09,25.4 62.23,25.4 60.96,26.67 60.96,27.94 | v44.45,13.97 v54.61,13.97 | 60.96,27.94 R5.2
  Bottom 0.813: v57.15,27.94 55.88,26.67 55.88,15.24 v54.61,13.97 | v44.45,13.97 43.69,14.73 34.29,14.73 33.02,13.46 BACKPLANE_LOGIC.4 | CONVERSION.4 142.24,7.62 139.7,5.08 132.08,5.08 130.81,6.35 130.81,51.31 128.78,53.34 v107.95,53.34
+5V  (via drill 0.35, 1)
  Top 2.286: 5V_POE.1 127,13.97
  Top 2.794: CONVERSION.3@2 136.65,13.97 127,13.97 v95.25,13.97 | CONVERSION.3@1 CONVERSION.3@2 | CONVERSION.3@2 CONVERSION.3@3
  Bottom 2.794: 21.59,7.62 21.59,5.08 24.26,2.41 46.86,2.41 58.42,13.97 v95.25,13.97 | 21.59,7.62 21.59,10.16 24.13,12.7 BACKPLANE_LOGIC.1 BACKPLANE_LOGIC.2 BACKPLANE_LOGIC.3 | 21.59,7.62 v17.78,7.62
+12V  (via drill 0.35, 1)  (1 unrouted)
  Top 0.203: Q4.3 106.68,40.95 | 43.18,29.21 44.45,30.48 44.45,41.91 43.18,43.18 41.91,43.18 41.53,42.8 | 41.53,42.8 41.15,42.42 41.15,39.88 40.34,39.08 U1.8 | 41.53,42.8 39.37,44.96 31.75,44.96 29.21,42.42 D6.A | D8.A 130.81,27.18 130.3,26.67 v125.73,26.67 125.73,29.21 | U3.1 16.83,28.89 16.51,29.21 16.51,30.48 17.02,30.99 22.35,30.99 v22.86,30.48 22.86,29.72 22.03,28.89 U3.6 | v31.75,30.48 36.83,30.48 | U2.8 109.52,29.5 v109.22,29.21 | U4.1 126.05,29.53 125.73,29.21 | U4.6 126.05,35.24 125.73,35.56 125.22,35.56 124.46,34.8 124.46,30.48 125.73,29.21
  Bottom 0.203: v22.86,30.48 v31.75,30.48 | v106.68,31.75 106.68,30.48 107.95,29.21 v109.22,29.21 110.49,27.94 118.11,27.94 119.38,26.67 v125.73,26.67
  other vias: 58.42,17.78
  pour Top: 34.29,25.4 35.56,24.13 44.45,24.13 60.96,7.62 60.96,1.27 67.31,-5.08 85.09,-5.08 88.9,-1.27 88.9,8.89 107.95,27.94 107.95,43.18 106.68,44.45 93.98,44.45 92.71,43.18 92.71,29.21 81.28,17.78 66.04,17.78 49.53,34.29 35.56,34.29 34.29,33.02
+12V_A  (via drill 0.35, 1)
  Top 0.203: Q3.2 27.69,26.67 25.4,28.96 v25.4,31.75 | v33.02,37.08 34.46,37.08 U1.4 | U3.4 21.27,26.99 21.59,26.67 24.13,26.67
  Bottom 0.203: v25.4,31.75 25.4,34.29 28.19,37.08 v33.02,37.08
  other vias: 25.4,26.67
  pour Top: 22.86,15.24 43.18,15.24 44.45,16.51 44.45,21.59 43.18,22.86 34.29,22.86 33.02,24.13 24.13,24.13 21.59,21.59 21.59,16.51
  pour Top (no thermals): 24.13,21.59 22.86,22.86 22.86,26.67 25.4,29.21 31.75,29.21 33.02,27.94 33.02,22.86 31.75,21.59
+12V_B  (via drill 0.35, 1)
  Top 0.203: U2.4 116.55,31.45 118.11,33.02 120.65,33.02 124.46,36.83 124.46,38.1 | 124.46,38.1 124.46,40.64 | U4.4 127.95,35.24 128.27,35.56 v128.27,36.83 | v125.73,38.1 124.46,38.1
  Bottom 0.203: v128.27,36.83 127,38.1 v125.73,38.1
  other vias: 125.73,41.91
  pour Top: 125.73,39.37 127,40.64 127,44.45 129.54,46.99 129.54,52.07 128.27,53.34 110.49,53.34 109.22,52.07 109.22,45.72 110.49,44.45 115.57,44.45 116.84,43.18 116.84,40.64 118.11,39.37
+48V  (via drill 1)
  Top 0.203: R1.2 52.07,58.42 50.8,59.69
  other vias: 113.03,66.04
  pour Top: 19.05,15.24 20.32,16.51 20.32,54.61 25.4,59.69 124.46,59.69 132.08,52.07 132.08,48.26 134.62,45.72 146.05,45.72 154.94,54.61 154.94,69.85 148.59,76.2 3.81,76.2 -2.54,69.85 -2.54,21.59 3.81,15.24
  cutout Top: 6.35,52.07 19.05,52.07 19.05,46.99 6.35,46.99
  cutout Top: 143.51,59.18 143.51,56.64 148.59,56.64 148.59,59.18
ALERT_1  (via drill 0.35)
  Top 0.203: v50.8,34.29 53.34,36.83 v67.31,36.83 BRICK_A.D | R5.1 66.04,27.94 v67.31,29.21
  Bottom 0.203: v50.8,34.29 49.53,33.02 49.53,15.24 46.99,12.7 46.99,10.16 44.45,7.62 36.83,7.62 35.56,8.89 BACKPLANE_LOGIC.11 | v67.31,29.21 v67.31,36.83
ALERT_2  (via drill 0.35)
  Top 0.203: v52.07,12.7 v43.69,12.7 | v68.58,30.48 57.15,30.48 v55.88,29.21 | R6.1 80.01,33.02 BRICK_B.D
  Bottom 0.203: v55.88,29.21 54.61,27.94 54.61,15.24 v52.07,12.7 | v43.69,12.7 42.42,11.43 34.29,11.43 BACKPLANE_LOGIC.10 | BRICK_B.D 77.47,30.48 v68.58,30.48
C2_1  (via drill 0.35)
  Top 0.203: v53.34,31.75 54.61,33.02 69.85,33.02 BRICK_A.A
  Bottom 0.203: v53.34,31.75 52.07,30.48 52.07,15.24 49.53,12.7 49.53,10.16 45.47,6.1 29.46,6.1 27.94,7.62 BACKPLANE_LOGIC.8
C2_2  (via drill 0.35)
  Top 0.203: BRICK_B.A 77.47,39.37 74.93,41.91 71.12,41.91 v69.85,40.64 | v68.58,31.75 55.88,31.75 v54.61,30.48
  Bottom 0.203: v54.61,30.48 53.34,29.21 53.34,15.24 50.8,12.7 50.8,10.16 45.97,5.33 27.69,5.33 25.4,7.62 BACKPLANE_LOGIC.7 | v69.85,40.64 69.85,33.02 v68.58,31.75
CLK  (via drill 0.35)
  Top 0.203: v52.07,33.02 53.34,34.29 BRICK_A.C | R7.1 81.28,36.83 BRICK_B.C
  Bottom 0.203: v52.07,33.02 50.8,31.75 50.8,15.24 48.26,12.7 48.26,10.16 44.96,6.86 31.24,6.86 30.48,7.62 BACKPLANE_LOGIC.9 | BRICK_A.C BRICK_B.C
DATA  (via drill 0.35)
  Top 0.203: v49.53,35.56 53.34,39.37 BRICK_A.E 74.93,39.37 76.2,38.1 76.2,30.48 77.47,29.21 BRICK_B.E R4.1
  Bottom 0.203: v49.53,35.56 48.26,34.29 48.26,15.24 45.72,12.7 45.72,10.16 44.45,8.89 39.37,8.89 BACKPLANE_LOGIC.12
GND_RAW
  pour Bottom: 39.37,64.77 39.37,76.2 40.64,77.47 83.82,77.47 86.36,74.93 86.36,63.5 82.55,59.69 63.5,59.69 59.69,63.5 40.64,63.5
LED_DRIVE_A
  Top 0.203: Q5.1 22.21,39.99 21.59,39.37 19.81,39.37 19.05,38.61 19.05,37.34 19.56,36.83 | 19.56,36.83 R8.2 | 19.56,36.83 19.05,36.32 19.05,33.53 19.56,33.02 D5.A
LED_DRIVE_B
  Top 0.203: Q6.1 139.08,31.13 140.97,33.02 140.97,34.29 | D7.A 140.21,38.1 140.97,37.34 140.97,34.29 | R10.2 140.97,34.29
N$1  (via drill 0.35)
  Top 0.203: v106.68,55.88 115.45,55.88 116.84,57.27 D2.A
  Bottom 0.203: D3.C 105.41,54.61 v106.68,55.88
N$4
  Top 0.203: R9.2 26.67,43.18 25.4,44.45 23.37,44.45 22.86,43.94 Q5.3
N$5
  Top 0.203: D6.C 29.21,38.61 28.45,37.85 27.43,37.85 26.67,38.61 R9.1
N$6
  Top 0.203: R11.2 134.62,27.18 135.38,26.42 137.67,26.42 138.43,27.18 Q6.3
N$7
  Top 0.203: D8.C 130.81,31.24 131.57,32 133.86,32 134.62,31.24 R11.1
ON/OFF  (via drill 0.35)
  Top 0.203: 112.61,58.42 R3.1 113.03,57.66 112.52,57.15 v111.76,57.15
  Bottom 0.203: 85.09,41.91 93.98,50.8 103.63,50.8 107.95,55.12 107.95,57.15 | 85.09,41.91 72.39,41.91 71.12,40.64 71.12,33.02 72.39,31.75 BRICK_A.B | 85.09,41.91 85.09,39.37 82.55,36.83 BRICK_B.B | 109.22,57.15 D4.C | v111.76,57.15 109.22,57.15 | Q2.3 106.68,59.69 107.95,58.42 107.95,57.15 | 109.22,57.15 107.95,57.15
ON/OFF_DRIVE
  Bottom 0.203: Q2.1 101.94,59.04 101.33,58.42 | 101.33,58.42 R2.2 | D3.A 100.84,54.61 100.33,55.12 100.33,55.88 101.33,56.88 101.33,58.42
OR_DRIVE_A
  Top 0.203: U1.2 32.08,38.42 30.23,36.58 30.23,35.56 | U1.6 41.22,37.77 41.91,37.08 41.91,36.07 41.4,35.56 30.23,35.56 | Q3.1 27.94,31.75 26.67,33.02 | 26.67,33.02 26.67,34.29 27.94,35.56 30.23,35.56 | D5.C 24.13,33.02 | 24.13,33.02 26.67,33.02 | U3.5 22.61,27.94 24.13,29.46 24.13,33.02
OR_DRIVE_B  (via drill 0.35)
  Top 0.203: U2.2 116.52,30.16 v116.84,30.48 | U2.6 108.89,30.8 107.95,31.75 107.95,32.51 108.46,33.02 v114.3,33.02 | D7.C 128.27,38.1 127,36.83 | 127,36.83 v125.73,36.83 | v123.19,36.83 Q4.1 | U4.5 127,36.83
  Bottom 0.203: v116.84,30.48 116.84,31.75 115.57,33.02 | 115.57,33.02 v114.3,33.02 | v125.73,36.83 124.46,36.83 | 124.46,36.83 v123.19,36.83 | 115.57,33.02 116.84,34.29 123.19,34.29 124.46,35.56 124.46,36.83
REV_DRIVE  (via drill 0.35)
  Top 0.203: R1.1 v62.23,58.42
  Bottom 0.203: Q1.1 80.1,54.36 76.04,58.42 67.31,58.42 | 67.31,58.42 v62.23,58.42 | D1.C 67.31,58.42
VCAPH_A  (via drill 0.35)
  Top 0.203: U1.7 40.97,38.42 41.91,39.37 v41.91,40.64 | C1.1 v39.37,43.18
  Bottom 0.203: v41.91,40.64 41.91,41.57 40.3,43.18 v39.37,43.18
VCAPH_B
  Top 0.203: U2.7 107.88,30.16 107.44,29.72 107.44,28.45 107.95,27.94 122.17,27.94 122.68,28.45 122.68,28.96 122.17,29.46 C2.1
VCAPL_A
  Top 0.203: U1.1 33.31,39.08 31.75,40.64 31.75,41.91 33.02,43.18 C1.2
VCAPL_B
  Top 0.203: U2.1 115.4,29.46 C2.2

### Text on the board
tValues: +48V | 48V_GND | 48V_ETHERNET | +12V_B | LM74610 | LM74610 | +12V_A | +12V | 12V_GND | +5V | 5V_ETHERNET
bValues: +48V | 48V_GND | +12V | 12V_GND | +5V